# Altium schematic sheet NeoCortex.SchDoc: NeoCortex
size A4; Organization: Altium Limited; SheetNumber: 1; SheetTotal: 5; License: CC-BY-SA 3.0; Version: 0.1; Project: NeoCortex
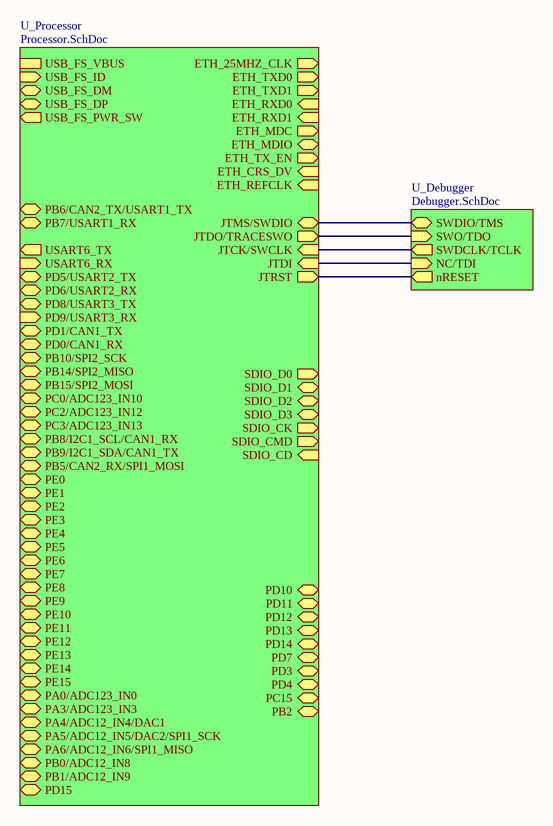
[diagram p0: NeoCortex.SchDoc]

## Sub-sheets
U_Debugger = Debugger.SchDoc: SWDIO/TMS (bidir), SWDCLK/TCLK (out), SWO/TDO (in), nRESET (out), NC/TDI (in)
U_Processor = Processor.SchDoc: SDIO_CD (in), SDIO_D0 (out), SDIO_D1 (bidir), SDIO_D2 (bidir), SDIO_D3 (bidir), SDIO_CK (out), SDIO_CMD (out), USB_FS_VBUS, USB_FS_ID (in), USB_FS_DM (bidir), USB_FS_DP (bidir), ETH_25MHZ_CLK (out), ETH_REFCLK (in), ETH_MDIO (bidir), ETH_RXD0 (in), ETH_RXD1 (in), ETH_TXD0 (out), ETH_TXD1 (out), ETH_CRS_DV (in), ETH_MDC (out), ETH_TX_EN (out), PB6/CAN2_TX/USART1_TX (bidir), PB7/USART1_RX (bidir), USART6_TX (out), USART6_RX (in), PD5/USART2_TX (bidir), PD6/USART2_RX (bidir), PD8/USART3_TX (bidir), PD9/USART3_RX (in), PD1/CAN1_TX (bidir), PD0/CAN1_RX (bidir), PB10/SPI2_SCK (bidir), PB14/SPI2_MISO (bidir), PB15/SPI2_MOSI (bidir), PC0/ADC123_IN10 (bidir), PC2/ADC123_IN12 (bidir), PC3/ADC123_IN13 (bidir), PB8/I2C1_SCL/CAN1_RX (bidir), PB9/I2C1_SDA/CAN1_TX (bidir), PB5/CAN2_RX/SPI1_MOSI (bidir), PE0 (bidir), PE1 (bidir), PE2 (bidir), PE3 (bidir), PE4 (bidir), PE5 (bidir), PE6 (bidir), PE7 (bidir), PE8 (bidir), PE9 (bidir), PE10 (bidir), PE11 (bidir), PE12 (bidir), PE13 (bidir), PE14 (bidir), PE15 (bidir), PA0/ADC123_IN0 (bidir), PA3/ADC123_IN3 (bidir), PA4/ADC12_IN4/DAC1 (bidir), PA5/ADC12_IN5/DAC2/SPI1_SCK (bidir), PA6/ADC12_IN6/SPI1_MISO (bidir), PB0/ADC12_IN8 (bidir), PB1/ADC12_IN9 (bidir), USB_FS_PWR_SW (out), PD15 (bidir), JTMS/SWDIO (bidir), JTCK/SWCLK (in), JTDO/TRACESWO (out), JTRST (out), JTDI (in), PD10 (bidir), PD11 (bidir), PD12 (bidir), PD13 (bidir), PD14 (bidir), PD7 (bidir), PD3 (bidir), PD4 (bidir), PC15 (bidir), PB2 (bidir)

## Nets
(unnamed): sheet U_Processor/JTMS/SWDIO, sheet U_Debugger/SWDIO/TMS
(unnamed): sheet U_Processor/JTCK/SWCLK, sheet U_Debugger/SWDCLK/TCLK
(unnamed): sheet U_Processor/JTDO/TRACESWO, sheet U_Debugger/SWO/TDO
(unnamed): sheet U_Processor/JTRST, sheet U_Debugger/nRESET
(unnamed): sheet U_Processor/JTDI, sheet U_Debugger/NC/TDI

## Notes on the sheet
- Date:
- Time:
- Ver:
- Sheet
- of
- GADGET
- SANDBOX
- License: